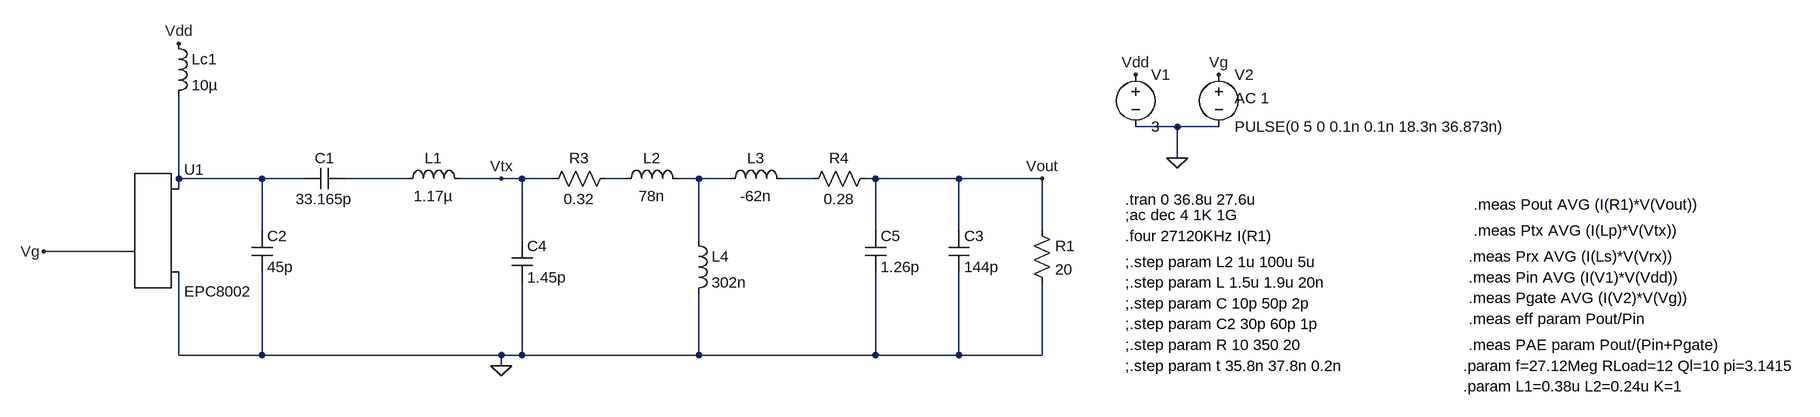
[diagram p0: schematic Draft3.asc]
Draft3.asc, the LTspice schematic file:
Version 4
SHEET 1 1552 680
WIRE -288 -400 -352 -400
WIRE -224 -400 -288 -400
WIRE -288 -352 -288 -400
WIRE -1824 -320 -1824 -448
WIRE -1696 -320 -1824 -320
WIRE -1632 -320 -1696 -320
WIRE -1472 -320 -1568 -320
WIRE -1328 -320 -1392 -320
WIRE -1296 -320 -1328 -320
WIRE -1248 -320 -1296 -320
WIRE -1136 -320 -1168 -320
WIRE -1024 -320 -1056 -320
WIRE -976 -320 -1024 -320
WIRE -848 -320 -896 -320
WIRE -752 -320 -768 -320
WIRE -624 -320 -752 -320
WIRE -496 -320 -624 -320
WIRE -1824 -304 -1824 -320
WIRE -1696 -240 -1696 -320
WIRE -752 -240 -752 -320
WIRE -624 -240 -624 -320
WIRE -496 -240 -496 -320
WIRE -1296 -224 -1296 -320
WIRE -1024 -224 -1024 -320
WIRE -1904 -208 -2032 -208
WIRE -1824 -48 -1824 -176
WIRE -1696 -48 -1696 -176
WIRE -1696 -48 -1824 -48
WIRE -1328 -48 -1696 -48
WIRE -1296 -48 -1296 -160
WIRE -1296 -48 -1328 -48
WIRE -1024 -48 -1024 -144
WIRE -1024 -48 -1296 -48
WIRE -752 -48 -752 -176
WIRE -752 -48 -1024 -48
WIRE -624 -48 -624 -176
WIRE -624 -48 -752 -48
WIRE -496 -48 -496 -160
WIRE -496 -48 -624 -48
WIRE -1328 -32 -1328 -48
FLAG -1824 -528 Vdd
FLAG -2032 -208 Vg
FLAG -288 -352 0
FLAG -352 -480 Vdd
FLAG -224 -480 Vg
FLAG -1328 -32 0
FLAG -496 -320 Vout
FLAG -1328 -320 Vtx
SYMBOL EPCGaN -1904 -208 R0
SYMATTR InstName U1
SYMATTR Value EPC8002
SYMBOL ind -1840 -544 R0
SYMATTR InstName Lc1
SYMATTR Value 10µ
SYMATTR SpiceLine Rser=0.1
SYMBOL ind -1488 -304 R270
WINDOW 0 32 56 VTop 2
WINDOW 3 5 56 VBottom 2
SYMATTR InstName L1
SYMATTR Value 1.17µ
SYMATTR SpiceLine Rser=0.1
SYMBOL cap -1568 -336 R90
WINDOW 0 0 32 VBottom 2
WINDOW 3 32 32 VTop 2
SYMATTR InstName C1
SYMATTR Value 33.165p
SYMATTR SpiceLine Rser=0.1
SYMBOL res -512 -256 R0
SYMATTR InstName R1
SYMATTR Value 20
SYMBOL voltage -352 -496 R0
WINDOW 123 0 0 Left 0
WINDOW 39 0 0 Left 0
SYMATTR InstName V1
SYMATTR Value 3
SYMBOL voltage -224 -496 R0
WINDOW 39 24 132 Left 2
WINDOW 123 24 52 Left 2
SYMATTR Value2 AC 1
SYMATTR InstName V2
SYMATTR Value PULSE(0 5 0 0.1n 0.1n 18.3n 36.873n)
SYMBOL cap -1712 -240 R0
SYMATTR InstName C2
SYMATTR Value 45p
SYMATTR SpiceLine Rser=0.1
SYMBOL cap -640 -240 R0
SYMATTR InstName C3
SYMATTR Value 144p
SYMBOL ind -1152 -304 R270
WINDOW 0 32 56 VTop 2
WINDOW 3 5 56 VBottom 2
SYMATTR InstName L2
SYMATTR Value 78n
SYMBOL ind -992 -304 R270
WINDOW 0 32 56 VTop 2
WINDOW 3 5 56 VBottom 2
SYMATTR InstName L3
SYMATTR Value -62n
SYMBOL ind -1040 -240 R0
SYMATTR InstName L4
SYMATTR Value 302n
SYMBOL res -1152 -336 R90
WINDOW 0 0 56 VBottom 2
WINDOW 3 32 56 VTop 2
SYMATTR InstName R3
SYMATTR Value 0.32
SYMBOL res -752 -336 R90
WINDOW 0 0 56 VBottom 2
WINDOW 3 32 56 VTop 2
SYMATTR InstName R4
SYMATTR Value 0.28
SYMBOL cap -768 -240 R0
SYMATTR InstName C5
SYMATTR Value 1.26p
SYMBOL cap -1312 -224 R0
SYMATTR InstName C4
SYMATTR Value 1.45p
TEXT -368 -288 Left 2 !.tran 0 36.8u 27.6u
TEXT -368 -264 Left 2 !;ac dec 4 1K 1G
TEXT -368 -160 Left 2 !;.step param L 1.5u 1.9u 20n
TEXT 168 -280 Left 2 !.meas Pout AVG (I(R1)*V(Vout))
TEXT 160 -168 Left 2 !.meas Pin AVG (I(V1)*V(Vdd))
TEXT 160 -104 Left 2 !.meas eff param Pout/Pin
TEXT -368 -232 Left 2 !.four 27120KHz I(R1)
TEXT -368 -64 Left 2 !;.step param R 10 350 20
TEXT -368 -192 Left 2 !;.step param L2 1u 100u 5u
TEXT -368 -128 Left 2 !;.step param C 10p 50p 2p
TEXT -368 -96 Left 2 !;.step param C2 30p 60p 1p
TEXT -368 -32 Left 2 !;.step param t 35.8n 37.8n 0.2n
TEXT 152 -32 Left 2 !.param f=27.12Meg RLoad=12 Ql=10 pi=3.1415
TEXT 160 -136 Left 2 !.meas Pgate AVG (I(V2)*V(Vg))
TEXT 160 -64 Left 2 !.meas PAE param Pout/(Pin+Pgate)
TEXT 168 -240 Left 2 !.meas Ptx AVG (I(Lp)*V(Vtx))
TEXT 160 -200 Left 2 !.meas Prx AVG (I(Ls)*V(Vrx))
TEXT 152 0 Left 2 !.param L1=0.38u L2=0.24u K=1

The netlist it stands for:
* Draft3.asc
XU1 Vg N001 0 EPC8002
Lc1 Vdd N001 10µ Rser=0.1
L1 N002 Vtx 1.17µ Rser=0.1
C1 N002 N001 33.165p Rser=0.1
R1 Vout 0 20
V1 Vdd 0 3
V2 Vg 0 PULSE(0 5 0 0.1n 0.1n 18.3n 36.873n) AC 1
C2 N001 0 45p Rser=0.1
C3 Vout 0 144p
L2 N003 N004 78n
L3 N004 N005 -62n
L4 N004 0 302n
R3 N003 Vtx 0.32
R4 Vout N005 0.28
C5 Vout 0 1.26p
C4 Vtx 0 1.45p
.tran 0 36.8u 27.6u
;ac dec 4 1K 1G
;.step param L 1.5u 1.9u 20n
.meas Pout AVG (I(R1)*V(Vout))
.meas Pin AVG (I(V1)*V(Vdd))
.meas eff param Pout/Pin
.four 27120KHz I(R1)
;.step param R 10 350 20
;.step param L2 1u 100u 5u
;.step param C 10p 50p 2p
;.step param C2 30p 60p 1p
;.step param t 35.8n 37.8n 0.2n
.param f=27.12Meg RLoad=12 Ql=10 pi=3.1415
.meas Pgate AVG (I(V2)*V(Vg))
.meas PAE param Pout/(Pin+Pgate)
.meas Ptx AVG (I(Lp)*V(Vtx))
.meas Prx AVG (I(Ls)*V(Vrx))
.param L1=0.38u L2=0.24u K=1
.backanno
.end